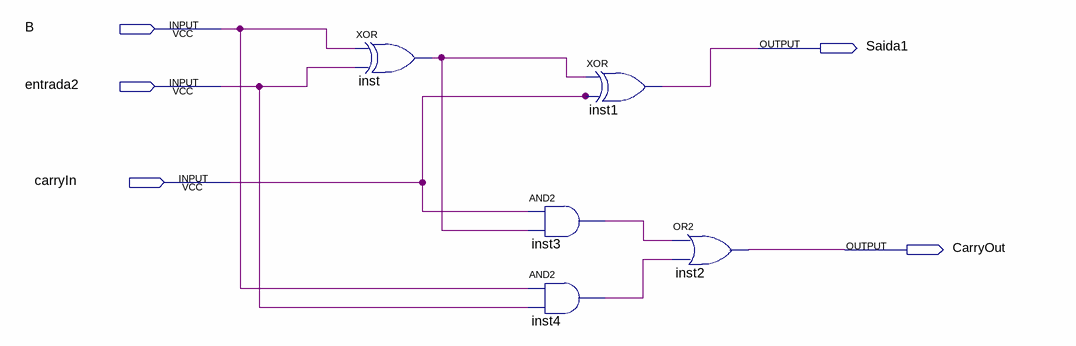
[diagram p0: schematic sheet]
// Quartus schematic fullAdder.bdf as structural Verilog: 5 symbols, 5 pins
module fullAdder (
  input  B,
  input  entrada2,
  input  carryIn,
  output Saida1,
  output CarryOut
);

  wire inst3_out, inst4_out, inst_out;

  xor inst (inst_out, B, entrada2);
  xor inst1 (Saida1, inst_out, carryIn);
  and inst3 (inst3_out, carryIn, inst_out);
  and inst4 (inst4_out, B, entrada2);
  or inst2 (CarryOut, inst3_out, inst4_out);
endmodule
